# EAGLE design SMS CONTROL (EAGLE 6.6.0)
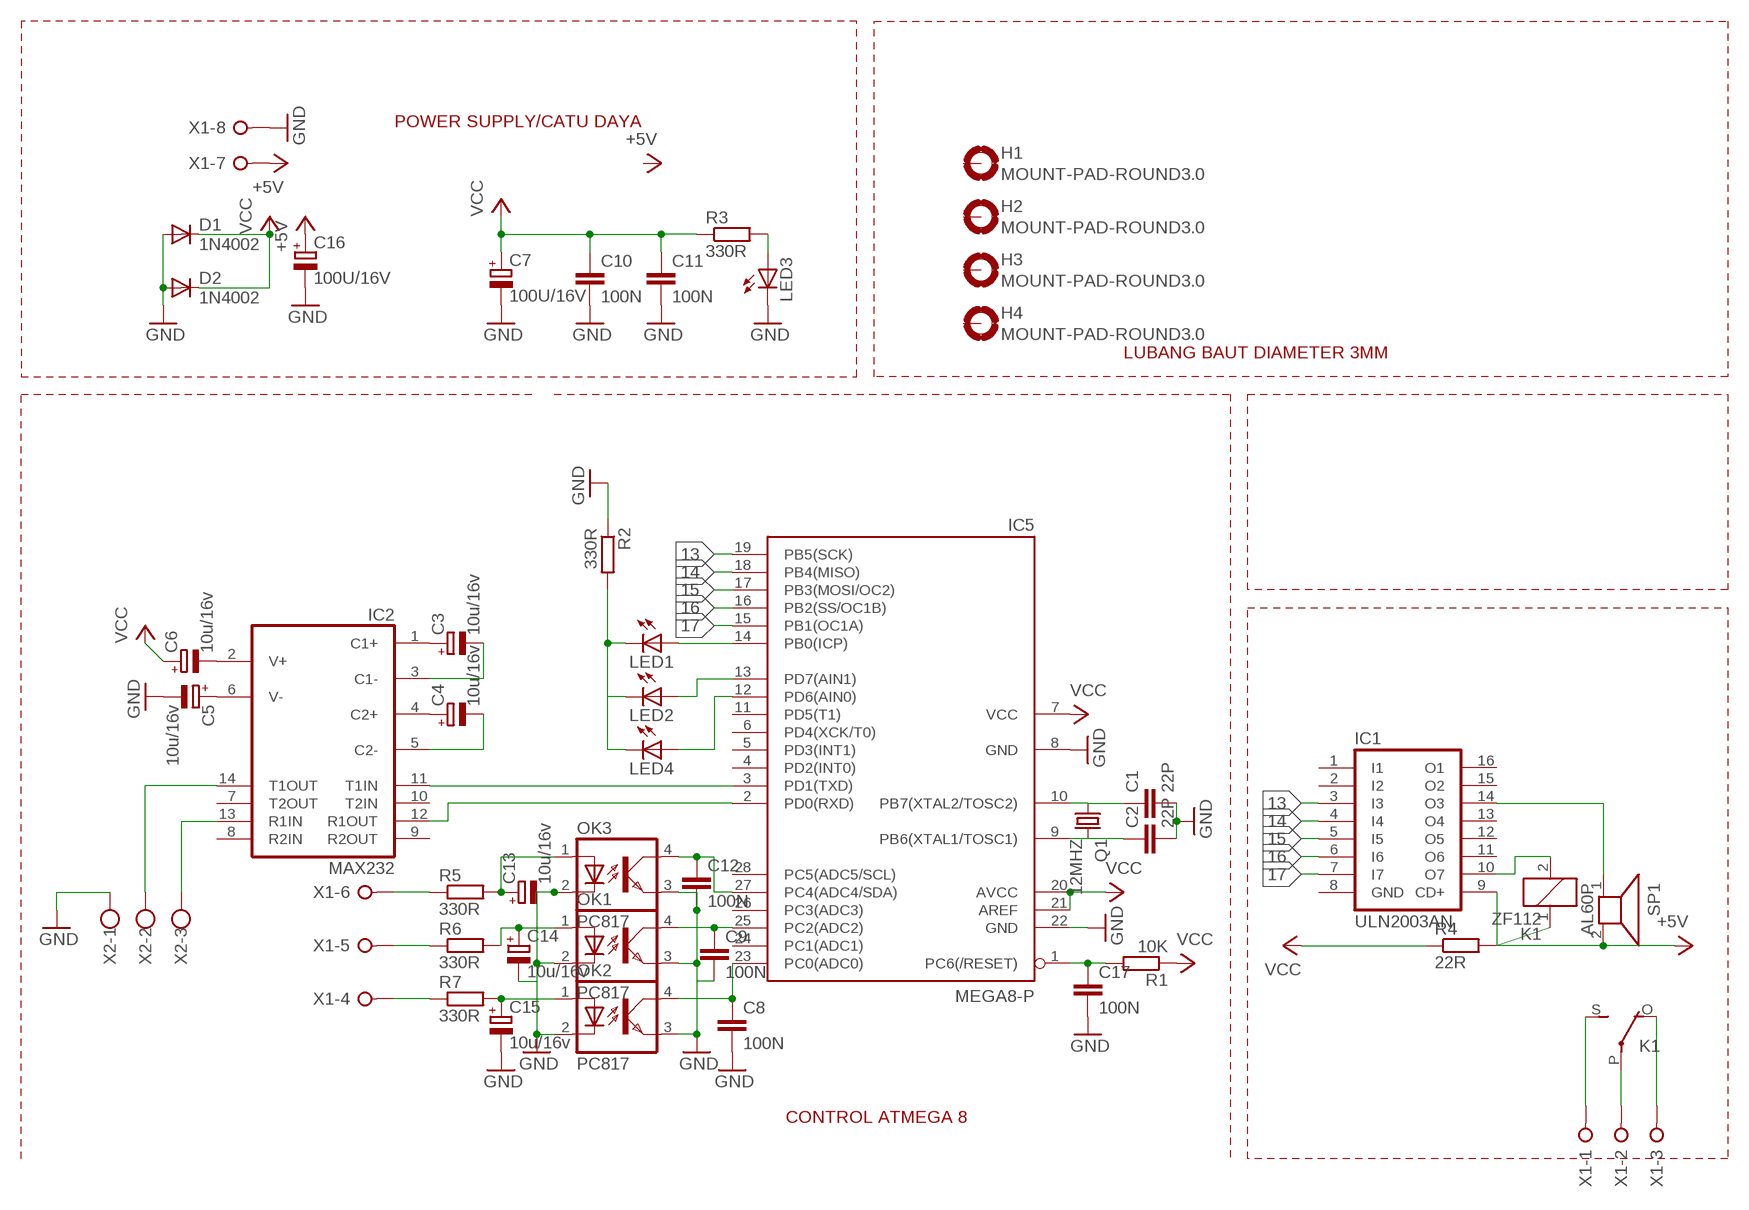
[diagram p0: schematic, sheet 1]

## Parts
C1  22P  C-EU025-025X050  [C025-025X050]
C2  22P  C-EU025-025X050  [C025-025X050]
C3  10u/16v  CPOL-EUE2.5-6  [E2,5-6]
C4  10u/16v  CPOL-EUE2.5-6  [E2,5-6]
C5  10u/16v  CPOL-EUE2.5-6  [E2,5-6]
C6  10u/16v  CPOL-EUE2.5-6  [E2,5-6]
C7  100U/16V  CPOL-EUE2.5-6  [E2,5-6]
C8  100N  C-EU025-025X050  [C025-025X050]
C9  100N  C-EU025-025X050  [C025-025X050]
C10  100N  C-EU075-032X103  [C075-032X103]
C11  100N  C-EU025-025X050  [C025-025X050]
C12  100N  C-EU025-025X050  [C025-025X050]
C13  10u/16v  CPOL-EUE2.5-6  [E2,5-6]
C14  10u/16v  CPOL-EUE2.5-6  [E2,5-6]
C15  10u/16v  CPOL-EUE2.5-6  [E2,5-6]
C16  100U/16V  CPOL-EUE2.5-6  [E2,5-6]
C17  100N  C-EU025-025X050  [C025-025X050]
D1  1N4002  1N4148DO35-10  [DO35-10]
D2  1N4002  1N4148DO35-10  [DO35-10]
H1  MOUNT-PAD-ROUND3.0  [3,0-PAD]
H2  MOUNT-PAD-ROUND3.0  [3,0-PAD]
H3  MOUNT-PAD-ROUND3.0  [3,0-PAD]
H4  MOUNT-PAD-ROUND3.0  [3,0-PAD]
IC1  ULN2003AN  [DIL16]
IC2  MAX232  [DIL16]
IC5  MEGA8-P  [DIL28-3]
K1  ZF112  [ZF112]
LED1  LED5MM  [LED5MM]
LED2  LED5MM  [LED5MM]
LED3  LED5MM  [LED5MM]
LED4  LED5MM  [LED5MM]
OK1  PC817  [DIL04]
OK2  PC817  [DIL04]
OK3  PC817  [DIL04]
Q1  12MHZ  CRYSTALHC49U-V  [HC49U-V]
R1  10K  R-EU_0207/10  [0207/10]
R2  330R  R-EU_0207/10  [0207/10]
R3  330R  R-EU_0207/10  [0207/10]
R4  22R  R-EU_0207/10  [0207/10]
R5  330R  R-EU_0207/10  [0207/10]
R6  330R  R-EU_0207/10  [0207/10]
R7  330R  R-EU_0207/10  [0207/10]
SP1  AL60P  [AL60P]
X1  W237-08P  [W237-8P]
X2  W237-103  [W237-103]

## Nets
13: IC1.3(I3) IC5.19(PB5(SCK))
14: IC1.4(I4) IC5.18(PB4(MISO))
15: IC1.5(I5) IC5.17(PB3(MOSI/OC2))
16: IC1.6(I6) IC5.16(PB2(SS/OC1B))
17: IC1.7(I7) IC5.15(PB1(OC1A))
+5V: C16.+ IC1.9(CD+) K1.1 R4.2 SP1.2 X1.7
GND: C1.2 C2.2 C5.- C7.- C8.2 C9.2 C10.2 C11.2 C12.2 C13.- C14.- C15.- C16.- C17.2 D1.A D2.A IC5.8(GND) IC5.22(GND) LED3.K(C) OK1.2(C) OK1.3(EMIT) OK2.2(C) OK2.3(EMIT) OK3.2(C) OK3.3(EMIT) R2.1 X1.8 X2.1
N$1: C17.1 IC5.1(PC6(/RESET)) R1.2
N$3: C13.+ OK3.1(A) R5.2
N$4: C14.+ OK1.1(A) R6.2
N$5: C9.1 IC5.25(PC2(ADC2)) OK1.4(COL)
N$6: C12.1 IC5.27(PC4(ADC4/SDA)) OK3.4(COL)
N$7: C15.+ OK2.1(A) R7.2
N$8: R5.1 X1.6
N$9: IC5.14(PB0(ICP)) LED1.A
N$10: IC2.12(R1OUT) IC5.2(PD0(RXD))
N$11: IC2.11(T1IN) IC5.3(PD1(TXD))
N$12: C2.1 IC5.9(PB6(XTAL1/TOSC1)) Q1.2
N$13: C1.1 IC5.10(PB7(XTAL2/TOSC2)) Q1.1
N$14: LED3.A R3.2
N$15: R6.1 X1.5
N$16: C3.+ IC2.1(C1+)
N$17: C3.- IC2.3(C1-)
N$18: C8.1 IC5.23(PC0(ADC0)) OK2.4(COL)
N$19: IC5.13(PD7(AIN1)) LED2.A
N$20: LED1.K(C) LED2.K(C) LED4.K(C) R2.2
N$21: R7.1 X1.4
N$22: C4.+ IC2.4(C2+)
N$23: C4.- IC2.5(C2-)
N$24: C5.+ IC2.6(V-)
N$25: C6.- IC2.2(V+)
N$26: IC2.13(R1IN) X2.3
N$27: IC2.14(T1OUT) X2.2
N$28: IC5.12(PD6(AIN0)) LED4.A
N$29: K1.S(2:S) X1.1
N$30: K1.P(2:P) X1.2
N$31: K1.O(2:O) X1.3
N$32: IC1.10(O7) K1.2
N$33: IC1.14(O3) SP1.1
VCC: C6.+ C7.+ C10.1 C11.1 D1.C D2.C IC5.7(VCC) IC5.20(AVCC) IC5.21(AREF) R1.1 R3.1 R4.1
Unconnected: H1.B3,0(MOUNT) H2.B3,0(MOUNT) H3.B3,0(MOUNT) H4.B3,0(MOUNT) IC1.1(I1) IC1.2(I2) IC1.11(O6) IC1.12(O5) IC1.13(O4) IC1.15(O2) IC1.16(O1) IC2.7(T2OUT) IC2.8(R2IN) IC2.9(R2OUT) IC2.10(T2IN) IC5.4(PD2(INT0)) IC5.5(PD3(INT1)) IC5.6(PD4(XCK/T0)) IC5.11(PD5(T1)) IC5.24(PC1(ADC1)) IC5.26(PC3(ADC3)) IC5.28(PC5(ADC5/SCL))

## Notes on the sheet
- POWER SUPPLY/CATU DAYA
- LUBANG BAUT DIAMETER 3MM
- CONTROL ATMEGA 8

## Power pins joined to a net without a drawn wire
GND: IC1.8(GND) IC2.15(GND)
VCC: IC2.16(VCC)

## Library data of the parts
C1 C2 C8-C12 C17 = resistor:C-EU: CAPACITOR, European symbol
C3-C7 C13-C16 = resistor:CPOL-EU: POLARIZED CAPACITOR, European symbol
D1 D2 = diode:1N4148: DIODE high speed (Philips)
H1-H4 = holes:MOUNT-PAD-ROUND: MOUNTING PAD, round
IC1 = uln-udn:ULN2003A: DRIVER ARRAY
IC2 = maxim:MAX232: RS232 TRANSEIVER; MF: MAXIM; MPN: MAX232ACPE+; OC_FARNELL: 9723773; OC_NEWARK: 68K4544
IC5 = atmel:MEGA8-P: MICROCONTROLLER 8 Kbytes FLASH, 1 kbytes SRAM, 512 bytes EEPROM, USART, 4-channel 10 bit ADC, 2-channel 8 bit ADC Pin compatible with Atmega48, ATMega88, ATMega168 Source: avr.lbr; OC_FARNELL: unknown; OC_NEWARK: unknown
K1 = relay:ZF112: RELAY 1 x switch; OC_FARNELL: unknown; OC_NEWARK: unknown
LED1-LED4 = led:LED: LED OSRAM: - CHIPLED LG R971, LG N971, LY N971, LG Q971, LY Q971, LO R971, LY R971 LH N974, LH R974 LS Q976, LO Q976, LY Q976 LO Q996 - Hyper CHIPLED LW Q18S LB Q993, LB Q99A, LB R99A - SideLED LS A670, LO A670, LY A670, LG A670, LP A670 LB A673, LV A673, LT A673, LW A673 LH A674 LY A675 LS A676, LA A676, LO A676, LY A676, LW A676 LS A679, LY A679, LG A679 - Hyper Micro SIDELED® LS Y876, LA Y876, LO Y876, LY Y876 LT Y87S - SmartLED LW L88C, LW L88S LB L89C, LB L89S, LG L890 LS L89K, LO L89K, LY L89K LS L896, LA L896, LO L896, LY L896 - TOPLED LS T670, LO T670, LY T670, LG T670, LP T670 LSG T670, LSP T670, LSY T670, LOP T670, LYG T670 LG T671, LOG T671, LSG T671 LB T673, LV T673, LT T673, LW T673 LH T674 LS T676, LA T676, LO T676, LY T676, LB T676, LH T676, LSB T676, LW T676 LB T67C, LV T67C, LT T67C, LS T67K, LO T67K, LY T67K, LW E67C LS E67B, LA E67B, LO E67B, LY E67B, LB E67C, LV E67C, LT E67C LW T67C LS T679, LY T679, LG T679 LS T770, LO T770, LY T770, LG T770, LP T770 LB T773, LV T773, LT T773, LW T773 LH T774 LS E675, LA E675, LY E675, LS T675 LS T776, LA T776, LO T776, LY T776, LB T776 LHGB T686 LT T68C, LB T68C - Hyper Mini TOPLED® LB M676 - Mini TOPLED Santana® LG M470 LS M47K, LO M47K, LY M47K Source: http://www.osram.convergy.de LUXEON: - LUMILED® LXK2-PW12-R00, LXK2-PW12-S00, LXK2-PW14-U00, LXK2-PW14-V00 LXK2-PM12-R00, LXK2-PM12-S00, LXK2-PM14-U00 LXK2-PE12-Q00, LXK2-PE12-R00, LXK2-PE12-S00, LXK2-PE14-T00, LXK2-PE14-U00 LXK2-PB12-K00, LXK2-PB12-L00, LXK2-PB12-M00, LXK2-PB14-N00, LXK2-PB14-P00, LXK2-PB14-Q00 LXK2-PR12-L00, LXK2-PR12-M00, LXK2-PR14-Q00, LXK2-PR14-R00 LXK2-PD12-Q00, LXK2-PD12-R00, LXK2-PD12-S00 LXK2-PH12-R00, LXK2-PH12-S00 LXK2-PL12-P00, LXK2-PL12-Q00, LXK2-PL12-R00 Source: www.luxeon.com KINGBRIGHT: KA-3528ASYC Source: www.kingbright.com
OK1-OK3 = optocoupler:PC817: SHARP OPTO COUPLER; MPN: PC817X4J000F; OC_FARNELL: 9707727; OC_NEWARK: 97K7059
Q1 = crystal:CRYSTAL: CRYSTAL; OC_FARNELL: 1666969; OC_NEWARK: unknown
R1-R7 = resistor:R-EU_: RESISTOR, European symbol
SP1 = buzzer:AL60P: SPEAKER Source: Buerklin; OC_FARNELL: unknown; OC_NEWARK: unknown
X1 = con-wago-508:W237-08P: WAGO SREW CLAMP; OC_FARNELL: unknown; OC_NEWARK: unknown
X2 = con-wago-500:W237-103: WAGO SCREW CLAMP; MPN: 237-103; OC_FARNELL: unknown; OC_NEWARK: 18M7116

## Board
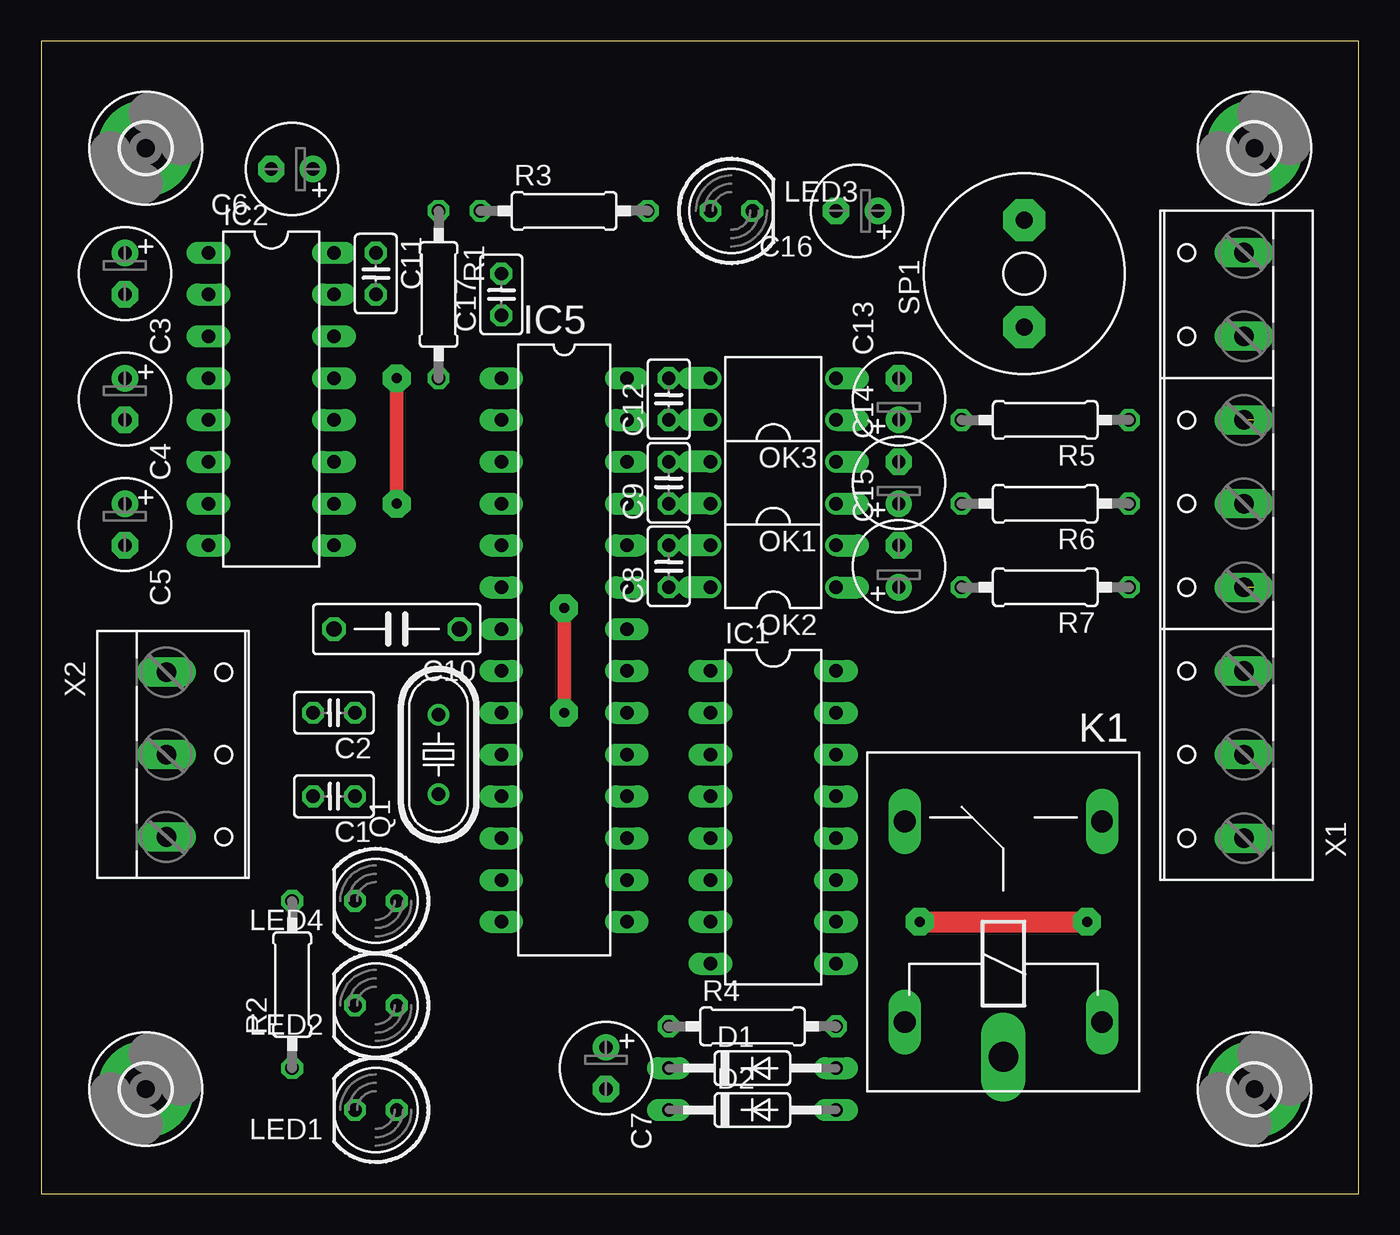
[diagram p1: board, top side]
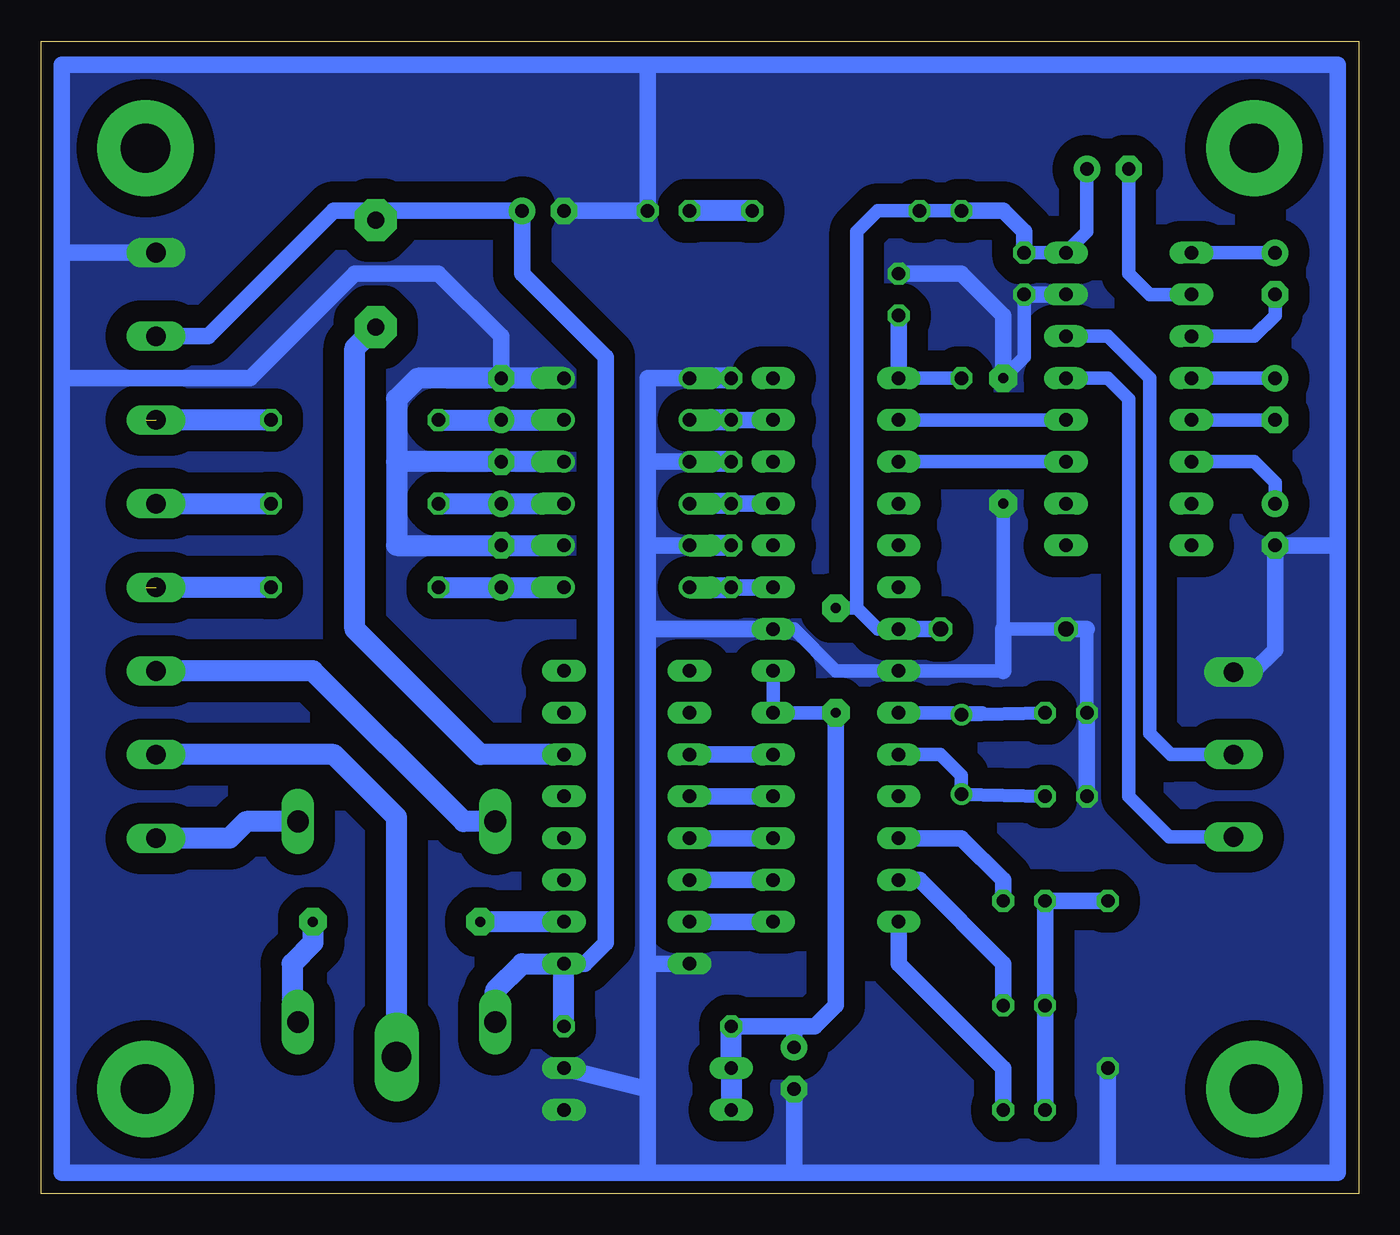
[diagram p2: board, bottom side, seen from below]

Size 80 x 70 mm. Coordinates in mm from the lower left corner, seen from the top.
Outline: 0,0 80,0 80,70 0,70 0,0
Copper layers (1*16): Top 0.035mm / dielectric 1.5mm / Bottom 0.035mm
Design rules "default": minimum track width 10mil, minimum drill 24mil, track to track 8mil, track to pad 8mil, pad to pad 8mil, via to via 8mil, smd to smd 8mil, copper to edge 40mil, drill to drill 8mil, minimum pad ring 10mil, minimum via ring 8mil, stop-mask expansion 4mil, vias tented up to drill 0mil, thermal gap 10mil

### Footprints (pad centres in the part's own frame; a part is rotated, then mirrored left to right if it is on the bottom)
C025-025X050 = drill 0.813 octagon: 1 -1.27,0; 2 1.27,0
E2,5-6 = drill 0.813 pad 1.6: + -1.27,0 | drill 0.813 pad 1.6 octagon: - 1.27,0
C075-032X103 = drill 0.914 octagon: 1 -3.81,0; 2 3.81,0
DO35-10 = drill 0.813 long: A 5.08,0; C -5.08,0
3,0-PAD = drill 3 pad 5.842: B3,0 0,0
DIL16 = drill 0.813 long: 1 -8.89,-3.81; 2 -6.35,-3.81; 3 -3.81,-3.81; 4 -1.27,-3.81; 5 1.27,-3.81; 6 3.81,-3.81; 7 6.35,-3.81; 8 8.89,-3.81; 9 8.89,3.81; 10 6.35,3.81; 11 3.81,3.81; 12 1.27,3.81; 13 -1.27,3.81; 14 -3.81,3.81; 15 -6.35,3.81; 16 -8.89,3.81
DIL28-3 = drill 0.813 long: 1 -16.51,-3.81; 2 -13.97,-3.81; 3 -11.43,-3.81; 4 -8.89,-3.81; 5 -6.35,-3.81; 6 -3.81,-3.81; 7 -1.27,-3.81; 8 1.27,-3.81; 9 3.81,-3.81; 10 6.35,-3.81; 11 8.89,-3.81; 12 11.43,-3.81; 13 13.97,-3.81; 14 16.51,-3.81; 15 16.51,3.81; 16 13.97,3.81; 17 11.43,3.81; 18 8.89,3.81; 19 6.35,3.81; 20 3.81,3.81; 21 1.27,3.81; 22 -1.27,3.81; 23 -3.81,3.81; 24 -6.35,3.81; 25 -8.89,3.81; 26 -11.43,3.81; 27 -13.97,3.81; 28 -16.51,3.81
ZF112 = drill 1.321 long: 1 -6.096,5.994; 2 -6.096,-5.994; O 6.096,5.994; S 6.096,-5.994 | drill 1.803 long: P -8.204,0
LED5MM = drill 0.813 octagon: A -1.27,0; K 1.27,0
DIL04 = drill 0.813 offset: 1 -1.27,-3.81; 2 1.27,-3.81; 3 1.27,3.81; 4 -1.27,3.81
HC49U-V = drill 0.813: 1 -2.413,0; 2 2.413,0
0207/10 = drill 0.813 octagon: 1 -5.08,0; 2 5.08,0
AL60P = drill 1.016 pad 2.54 octagon: 1 -3.251,0; 2 3.251,0
W237-8P = drill 1.194 long: 1 -17.78,-0.635; 2 -12.7,-0.635; 3 -7.62,-0.635; 4 -2.54,-0.635; 5 2.54,-0.635; 6 7.62,-0.635; 7 12.7,-0.635; 8 17.78,-0.635
W237-103 = drill 1.194 long: 1 -5,-1.29; 2 0,-1.29; 3 5,-1.29

### Placement (x,y rotation side)
C1  17.78,24.13 180 top
C2  17.78,29.21 180 top
C3  5.08,55.88 270 top
C4  5.08,48.26 270 top
C5  5.08,40.64 270 top
C6  15.24,62.23 180 top
C7  34.29,7.62 270 top
C8  38.1,38.1 90 top
C9  38.1,43.18 90 top
C10  21.59,34.29 180 top
C11  20.32,55.88 270 top
C12  38.1,48.26 90 top
C13  52.07,48.26 90 top
C14  52.07,43.18 90 top
C15  52.07,38.1 90 top
C16  49.53,59.69 180 top
C17  27.94,54.61 90 top
D1  43.18,7.62 0 top
D2  43.18,5.08 0 top
H1  6.35,6.35 0 top
H2  73.66,63.5 0 top
H3  6.35,63.5 0 top
H4  73.66,6.35 0 top
IC1  44.45,22.86 270 top
IC2  13.97,48.26 270 top
IC5  31.75,33.02 270 top
K1  58.42,16.51 90 top
LED1  20.32,5.08 180 top
LED2  20.32,11.43 180 top
LED3  41.91,59.69 0 top
LED4  20.32,17.78 180 top
OK1  44.45,43.18 90 top
OK2  44.45,38.1 90 top
OK3  44.45,48.26 90 top
Q1  24.13,26.67 90 top
R1  24.13,54.61 270 top
R2  15.24,12.7 90 top
R3  31.75,59.69 0 top
R4  43.18,10.16 0 top
R5  60.96,46.99 180 top
R6  60.96,41.91 180 top
R7  60.96,36.83 180 top
SP1  59.69,55.88 90 top
X1  72.39,39.37 90 top
X2  8.89,26.67 270 top

### Tracks (layer width: path | path; a pad name or v marks a point on that pad's centre or on a via)
13
  Bottom 1.016: IC1.3 IC5.19
14
  Bottom 1.016: IC5.18 IC1.4
15
  Bottom 1.016: IC1.5 IC5.17
16
  Bottom 1.016: IC5.16 IC1.6
17
  Bottom 1.016: IC1.7 IC5.15
+5V
  Bottom 1.016: X1.7 69.85,52.07 62.23,59.69 59.69,59.69 | 59.69,59.69 C16.+ 50.8,55.88 45.72,50.8 45.72,15.24 46.99,13.97 IC1.9 | SP1.2 59.69,59.69
  Bottom 1.27: R4.2 IC1.9 50.8,13.97 52.43,12.34 K1.1
GND  (via drill 0.6 pad 1.68)
  Top 0.813: v21.59,49.53 v21.59,41.91
  Bottom 0.813: 21.59,31.75 IC5.8 31.75,31.75 34.29,34.29 IC5.22 | C2.2 16.51,34.29 21.59,34.29 v21.59,41.91 | C11.2 20.32,50.8 v21.59,49.53
  Bottom 1.016: 43.18,68.58 1.27,68.58 1.27,39.37 | 43.18,68.58 78.74,68.58 78.74,57.15 | 78.74,57.15 78.74,49.53 | 78.74,49.53 78.74,1.27 43.18,1.27 | 1.27,39.37 1.27,1.27 15.24,1.27 | 15.24,1.27 34.29,1.27 | 34.29,1.27 43.18,1.27 | 1.27,39.37 C5.- 5.08,33.02 6.43,31.67 X2.1 | C11.2 IC2.15 | OK3.3 43.18,49.53 43.18,44.45 | 43.18,44.45 43.18,39.37 | 43.18,39.37 OK2.3 | OK1.3 43.18,44.45 | IC5.22 43.18,34.29 | 43.18,34.29 43.18,39.37 | IC1.8 43.18,13.97 | 43.18,13.97 43.18,34.29 | C10.2 16.51,34.29 | 21.59,31.75 21.59,34.29 | X1.8 78.74,57.15 | D1.A 43.18,6.35 | 43.18,6.35 43.18,13.97 | 43.18,6.35 43.18,1.27 | C7.- 34.29,1.27 | R2.1 15.24,1.27 | C1.2 C2.2 | 43.18,68.58 LED3.K C16.- | C13.- 52.07,52.07 55.88,55.88 60.96,55.88 67.31,49.53 78.74,49.53 | C17.2 24.13,55.88 21.59,53.34 v21.59,49.53
  Bottom 1.27: C12.2 OK3.3 | C9.2 OK1.3 | C8.2 OK2.3 | OK3.2 C13.- 57.15,49.53 58.42,48.26 58.42,44.45 | 58.42,44.45 58.42,39.37 C15.- OK2.2 | OK1.2 C14.- 58.42,44.45
  pour Bottom (isolate 1.27, no thermals): 0,70 80.16,70 80.01,0 0,0
N$1
  Bottom 0.813: R1.2 IC5.1
  Bottom 1.016: C17.1 IC5.1
N$3
  Bottom 1.27: R5.2 C13.+ OK3.1
N$4
  Bottom 1.27: R6.2 C14.+ OK1.1
N$5
  Bottom 1.016: C9.1 IC5.25
  Bottom 1.27: C9.1 OK1.4
N$6
  Bottom 1.016: IC5.27 C12.1
  Bottom 1.27: C12.1 OK3.4
N$7
  Bottom 1.27: R7.2 C15.+ OK2.1
N$8  (1 unrouted)
  Bottom 1.27: R5.1 73.66,46.99
N$9
  Bottom 1.016: IC5.14 27.94,13.97 21.59,7.62 LED1.A
N$10
  Bottom 0.813: IC2.12 IC5.2
N$11
  Bottom 0.813: IC5.3 IC2.11
N$12
  Bottom 0.813: IC5.9 22.86,29.21 Q1.2 C2.1
N$13
  Bottom 0.813: IC5.10 25.4,26.67 24.13,25.4 Q1.1 C1.1
N$14
  Bottom 1.27: R3.2 LED3.A
N$15
  Bottom 1.27: X1.5 R6.1
N$16
  Bottom 0.813: C3.+ IC2.1
N$17
  Bottom 0.813: C3.- 5.08,53.34 6.35,52.07 IC2.3
N$18
  Bottom 1.016: IC5.23 C8.1
  Bottom 1.27: OK2.4 C8.1
N$19
  Bottom 1.016: IC5.13 26.67,19.05 21.59,13.97 LED2.A
N$20
  Bottom 1.016: LED1.K LED2.K LED4.K R2.2
N$21  (1 unrouted)
  Bottom 1.27: R7.1 73.66,36.83
N$22
  Bottom 0.813: C4.+ IC2.4
N$23
  Bottom 0.813: C4.- IC2.5
N$24
  Bottom 0.813: C5.+ 5.08,43.18 6.35,44.45 IC2.6
N$25
  Bottom 0.813: IC2.2 12.7,54.61 13.97,55.88 C6.-
N$26
  Bottom 0.813: X2.3 11.51,21.67 13.97,24.13 13.97,48.26 15.24,49.53 IC2.13
N$27
  Bottom 0.813: IC2.14 15.24,52.07 12.7,49.53 12.7,27.94 11.43,26.67 X2.2
N$28
  Bottom 1.016: LED4.A 21.59,19.05 24.13,21.59 IC5.12
N$29
  Bottom 1.27: K1.S 67.56,22.61 68.58,21.59 X1.1 73.66,21.59
N$30
  Bottom 1.27: K1.P 58.42,22.86 62.23,26.67 X1.2
N$31
  Bottom 1.27: K1.O 54.36,22.61 63.5,31.75 X1.3
N$32  (via drill 0.6 pad 1.68)
  Top 1.27: v53.34,16.51 v63.5,16.51
  Bottom 1.27: IC1.10 v53.34,16.51 | v63.5,16.51 63.5,15.24 64.77,13.97 64.77,10.77 K1.2
N$33
  Bottom 1.27: IC1.14 53.34,26.67 60.96,34.29 60.96,51.36 SP1.1
VCC  (via drill 0.6 pad 1.68)
  Top 0.813: v31.75,35.56 v31.75,29.21
  Bottom 0.813: C6.+ 16.51,58.42 IC2.16 C11.1 | IC5.7 29.21,34.29 30.48,35.56 | 30.48,35.56 30.48,58.42 29.21,59.69 R3.1 R1.1 | IC5.21 IC5.20 v31.75,29.21 | 30.48,35.56 v31.75,35.56
  Bottom 1.016: v31.75,29.21 31.75,11.43 33.02,10.16 34.29,10.16 | C10.1 IC5.7 | 34.29,10.16 R4.1 | C7.+ 34.29,10.16 | C11.1 20.32,58.42 21.59,59.69 R1.1
  Bottom 1.27: D2.C D1.C R4.1